# EAGLE design debug-leds (EAGLE 7.7.0)
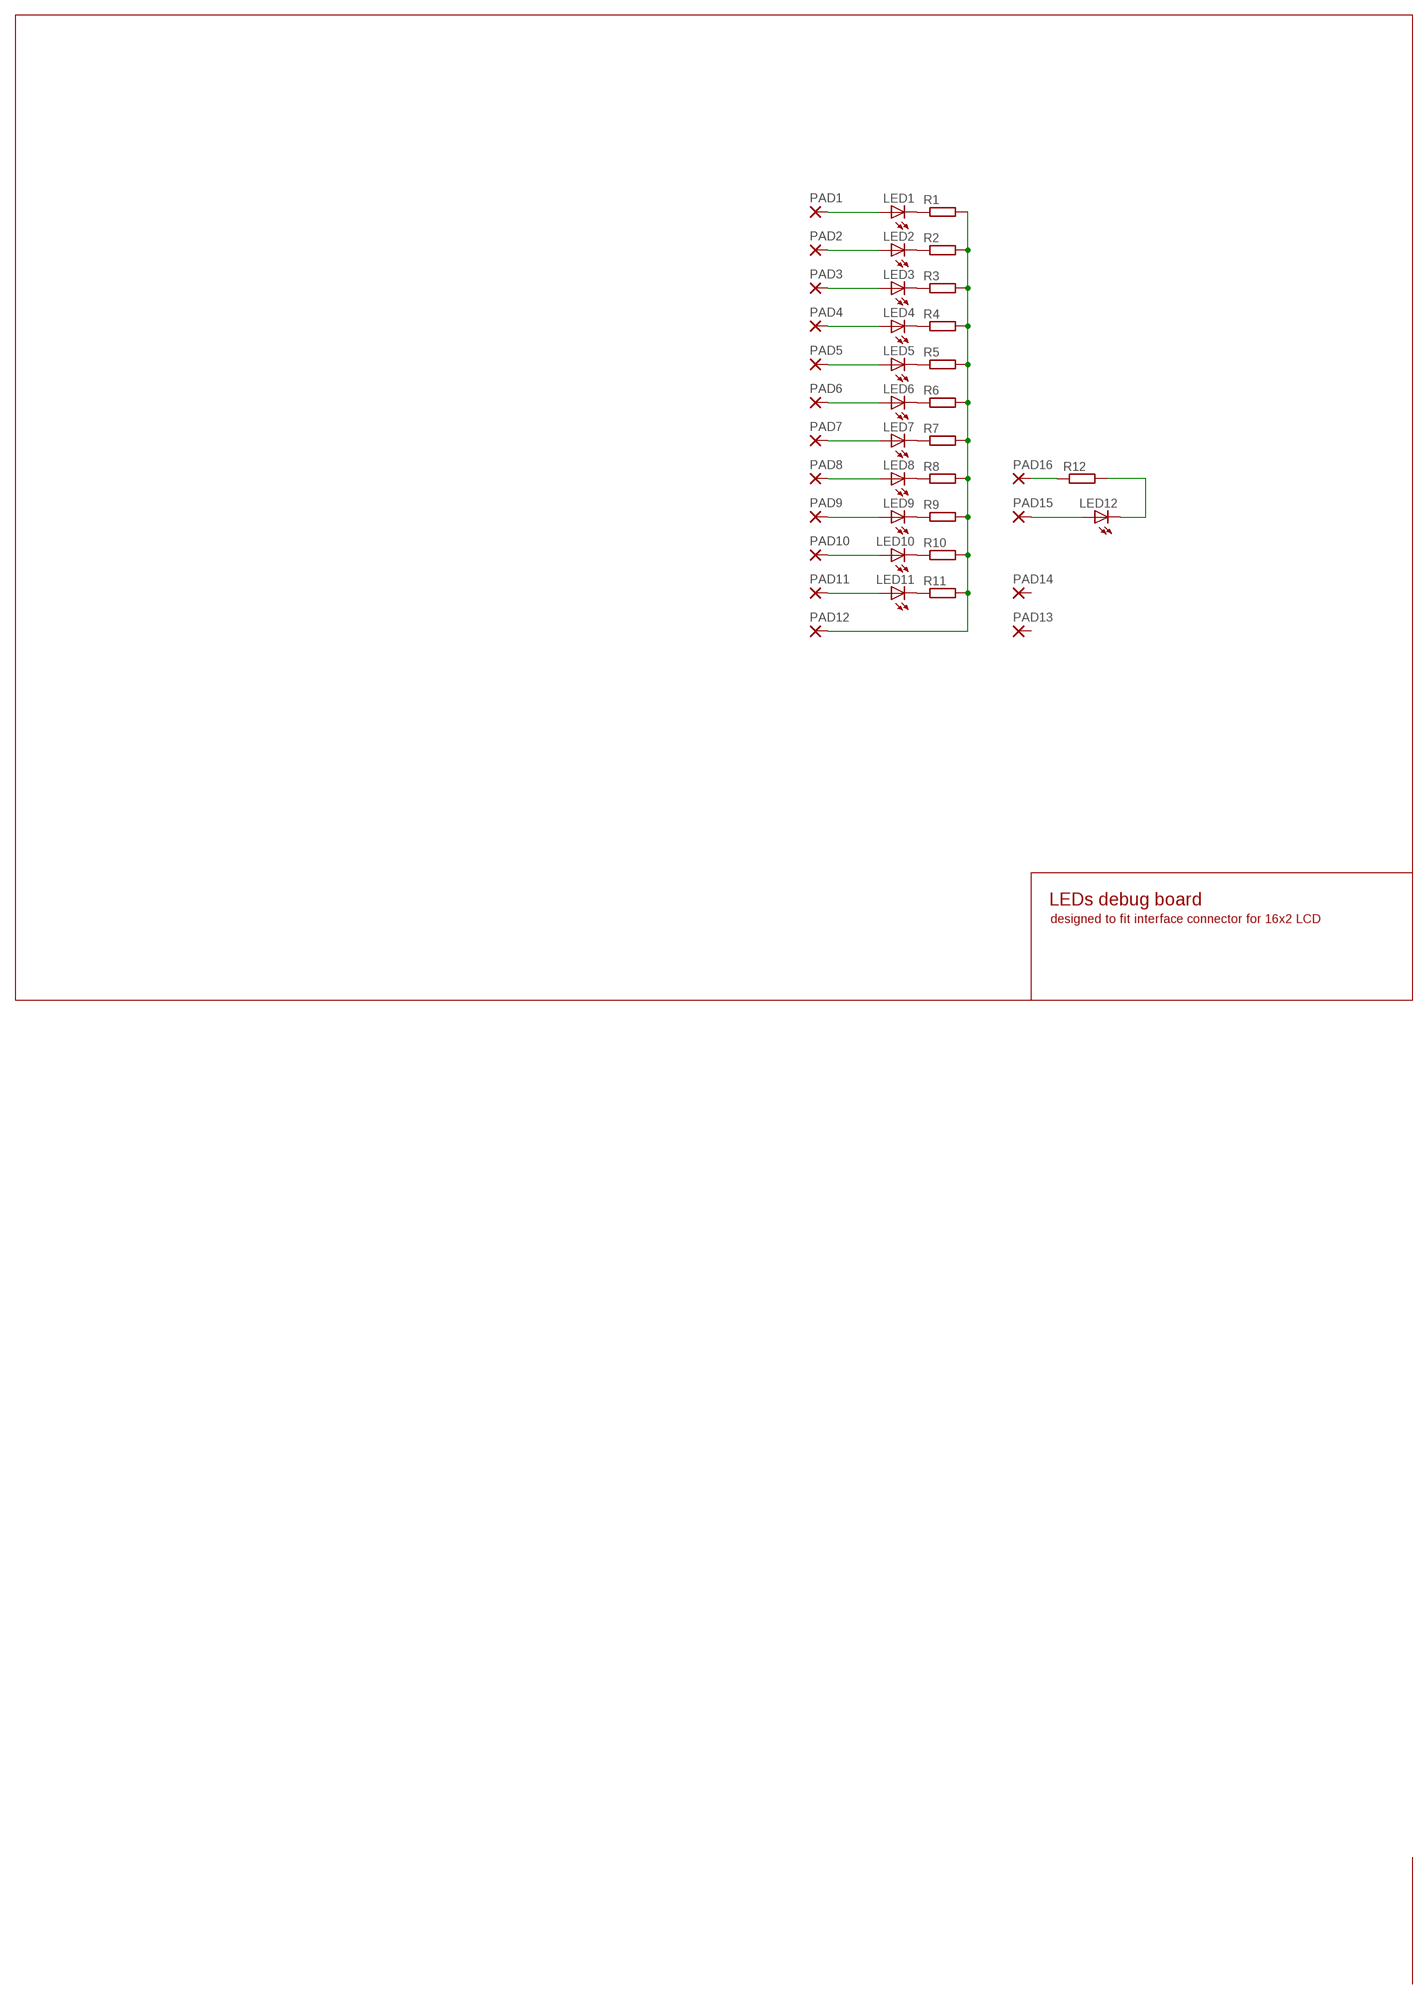
[diagram p0: schematic, sheet 1]

## Parts
LED1  LEDSML0805  [SML0805]
LED2  LEDSML0805  [SML0805]
LED3  LEDSML0805  [SML0805]
LED4  LEDSML0805  [SML0805]
LED5  LEDSML0805  [SML0805]
LED6  LEDSML0805  [SML0805]
LED7  LEDSML0805  [SML0805]
LED8  LEDSML0805  [SML0805]
LED9  LEDSML0805  [SML0805]
LED10  LEDSML0805  [SML0805]
LED11  LEDSML0805  [SML0805]
LED12  LEDSML0805  [SML0805]
PAD1  1,6/0,8  [1,6/0,8]
PAD2  1,6/0,8  [1,6/0,8]
PAD3  1,6/0,8  [1,6/0,8]
PAD4  1,6/0,8  [1,6/0,8]
PAD5  1,6/0,8  [1,6/0,8]
PAD6  1,6/0,8  [1,6/0,8]
PAD7  1,6/0,8  [1,6/0,8]
PAD8  1,6/0,8  [1,6/0,8]
PAD9  1,6/0,8  [1,6/0,8]
PAD10  1,6/0,8  [1,6/0,8]
PAD11  1,6/0,8  [1,6/0,8]
PAD12  1,6/0,8  [1,6/0,8]
PAD13  1,6/0,8  [1,6/0,8]
PAD14  1,6/0,8  [1,6/0,8]
PAD15  1,6/0,8  [1,6/0,8]
PAD16  1,6/0,8  [1,6/0,8]
R1  R-EU_M0805  [M0805]
R2  R-EU_M0805  [M0805]
R3  R-EU_M0805  [M0805]
R4  R-EU_M0805  [M0805]
R5  R-EU_M0805  [M0805]
R6  R-EU_M0805  [M0805]
R7  R-EU_M0805  [M0805]
R8  R-EU_M0805  [M0805]
R9  R-EU_M0805  [M0805]
R10  R-EU_M0805  [M0805]
R11  R-EU_M0805  [M0805]
R12  R-EU_M0805  [M0805]

## Nets
D6: LED2.A PAD2.1(P)
D7: LED1.A PAD1.1(P)
GND: PAD12.1(P) R1.2 R2.2 R3.2 R4.2 R5.2 R6.2 R7.2 R8.2 R9.2 R10.2 R11.2
N$1: LED9.A PAD9.1(P)
N$2: LED10.A PAD10.1(P)
N$3: LED3.A PAD3.1(P)
N$4: LED4.A PAD4.1(P)
N$5: LED5.A PAD5.1(P)
N$6: LED6.A PAD6.1(P)
N$7: LED7.A PAD7.1(P)
N$8: LED8.A PAD8.1(P)
N$9: LED1.C R1.1
N$10: LED2.C R2.1
N$11: LED3.C R3.1
N$12: LED4.C R4.1
N$13: LED5.C R5.1
N$14: LED6.C R6.1
N$15: LED7.C R7.1
N$16: LED8.C R8.1
N$17: LED11.A PAD11.1(P)
N$18: LED9.C R9.1
N$19: LED10.C R10.1
N$20: LED11.C R11.1
N$22: LED12.A PAD15.1(P)
N$23: LED12.C R12.2
N$24: PAD16.1(P) R12.1
Unconnected: PAD13.1(P) PAD14.1(P)

## Notes on the sheet
- LEDs debug board
- designed to fit interface connector for 16x2 LCD

## Library data of the parts
LED1-LED12 = led:LED: LED OSRAM: - CHIPLED LG R971, LG N971, LY N971, LG Q971, LY Q971, LO R971, LY R971 LH N974, LH R974 LS Q976, LO Q976, LY Q976 LO Q996 - Hyper CHIPLED LW Q18S LB Q993, LB Q99A, LB R99A - SideLED LS A670, LO A670, LY A670, LG A670, LP A670 LB A673, LV A673, LT A673, LW A673 LH A674 LY A675 LS A676, LA A676, LO A676, LY A676, LW A676 LS A679, LY A679, LG A679 - Hyper Micro SIDELED® LS Y876, LA Y876, LO Y876, LY Y876 LT Y87S - SmartLED LW L88C, LW L88S LB L89C, LB L89S, LG L890 LS L89K, LO L89K, LY L89K LS L896, LA L896, LO L896, LY L896 - TOPLED LS T670, LO T670, LY T670, LG T670, LP T670 LSG T670, LSP T670, LSY T670, LOP T670, LYG T670 LG T671, LOG T671, LSG T671 LB T673, LV T673, LT T673, LW T673 LH T674 LS T676, LA T676, LO T676, LY T676, LB T676, LH T676, LSB T676, LW T676 LB T67C, LV T67C, LT T67C, LS T67K, LO T67K, LY T67K, LW E67C LS E67B, LA E67B, LO E67B, LY E67B, LB E67C, LV E67C, LT E67C LW T67C LS T679, LY T679, LG T679 LS T770, LO T770, LY T770, LG T770, LP T770 LB T773, LV T773, LT T773, LW T773 LH T774 LS E675, LA E675, LY E675, LS T675 LS T776, LA T776, LO T776, LY T776, LB T776 LHGB T686 LT T68C, LB T68C - Hyper Mini TOPLED® LB M676 - Mini TOPLED Santana® LG M470 LS M47K, LO M47K, LY M47K Source: http://www.osram.convergy.de LUXEON: - LUMILED® LXK2-PW12-R00, LXK2-PW12-S00, LXK2-PW14-U00, LXK2-PW14-V00 LXK2-PM12-R00, LXK2-PM12-S00, LXK2-PM14-U00 LXK2-PE12-Q00, LXK2-PE12-R00, LXK2-PE12-S00, LXK2-PE14-T00, LXK2-PE14-U00 LXK2-PB12-K00, LXK2-PB12-L00, LXK2-PB12-M00, LXK2-PB14-N00, LXK2-PB14-P00, LXK2-PB14-Q00 LXK2-PR12-L00, LXK2-PR12-M00, LXK2-PR14-Q00, LXK2-PR14-R00 LXK2-PD12-Q00, LXK2-PD12-R00, LXK2-PD12-S00 LXK2-PH12-R00, LXK2-PH12-S00 LXK2-PL12-P00, LXK2-PL12-Q00, LXK2-PL12-R00 Source: www.luxeon.com KINGBRIGHT: KA-3528ASYC Source: www.kingbright.com
PAD1-PAD16 = wirepad:1,6/0,8: THROUGH-HOLE PAD
R1-R12 = rcl:R-EU_: RESISTOR, European symbol

## Board
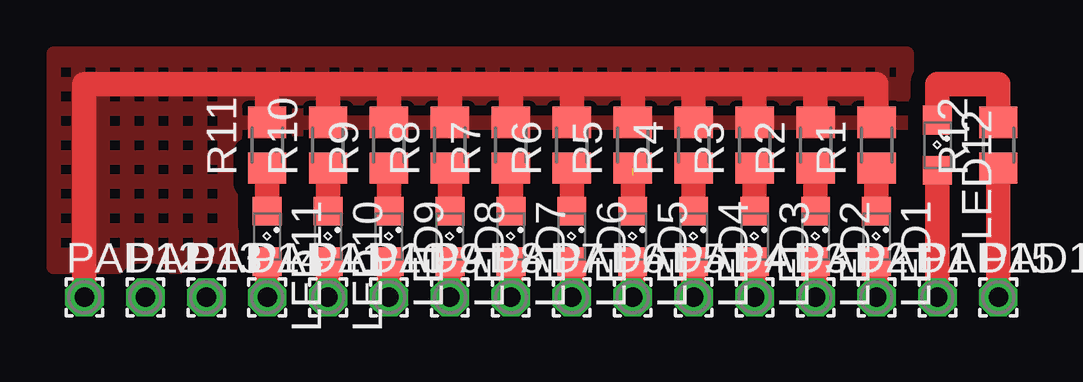
[diagram p1: board, top side]

No outline drawn. Coordinates in mm, seen from the top.
Copper layers (1*16): Top 0.035mm / dielectric 1.5mm / Bottom 0.035mm
Design rules "default": minimum track width 10mil, minimum drill 24mil, track to track 8mil, track to pad 8mil, pad to pad 8mil, via to via 8mil, smd to smd 8mil, copper to edge 40mil, drill to drill 8mil, minimum pad ring 10mil, minimum via ring 8mil, stop-mask expansion 4mil, vias tented up to drill 0mil, thermal gap 10mil

### Footprints (pad centres in the part's own frame; a part is rotated, then mirrored left to right if it is on the bottom)
SML0805 = smd 1.2 x 1.2: A 1.05,0; C -1.05,0
1,6/0,8 = drill 0.813 pad 1.6 octagon: 1 0,0
M0805 = smd 1.3 x 1.6: 1 -0.95,0; 2 0.95,0

### Placement (x,y rotation side)
LED1  34.29,3.81 270 top
LED2  31.75,3.81 270 top
LED3  29.21,3.81 270 top
LED4  26.67,3.81 270 top
LED5  24.13,3.81 270 top
LED6  21.59,3.81 270 top
LED7  19.05,3.81 270 top
LED8  16.51,3.81 270 top
LED9  13.97,3.81 270 top
LED10  11.43,3.81 270 top
LED11  8.89,3.81 270 top
LED12  36.83,7.62 270 top
PAD1  34.29,1.27 0 top
PAD2  31.75,1.27 0 top
PAD3  29.21,1.27 0 top
PAD4  26.67,1.27 0 top
PAD5  24.13,1.27 0 top
PAD6  21.59,1.27 0 top
PAD7  19.05,1.27 0 top
PAD8  16.51,1.27 0 top
PAD9  13.97,1.27 0 top
PAD10  11.43,1.27 0 top
PAD11  8.89,1.27 0 top
PAD12  1.27,1.27 0 top
PAD13  3.81,1.27 0 top
PAD14  6.35,1.27 0 top
PAD15  36.83,1.27 0 top
PAD16  39.37,1.27 0 top
R1  34.29,7.62 90 top
R2  31.75,7.62 90 top
R3  29.21,7.62 90 top
R4  26.67,7.62 90 top
R5  24.13,7.62 90 top
R6  21.59,7.62 90 top
R7  19.05,7.62 90 top
R8  16.51,7.62 90 top
R9  13.97,7.62 90 top
R10  11.43,7.62 90 top
R11  8.89,7.62 90 top
R12  39.37,7.62 90 top

### Tracks (layer width: path | path; a pad name or v marks a point on that pad's centre or on a via)
D6
  Top 1.016: PAD2.1 LED2.A
D7
  Top 1.016: PAD1.1 LED1.A
GND
  Top 1.016: PAD12.1 1.27,10.16 8.89,10.16 | 8.89,10.16 11.43,10.16 | 11.43,10.16 13.97,10.16 | 13.97,10.16 16.51,10.16 | 16.51,10.16 19.05,10.16 | 19.05,10.16 21.59,10.16 | 21.59,10.16 24.13,10.16 | 24.13,10.16 26.67,10.16 | 26.67,10.16 29.21,10.16 | 29.21,10.16 31.75,10.16 | 31.75,10.16 34.29,10.16 R1.2 | R2.2 31.75,10.16 | R3.2 29.21,10.16 | R4.2 26.67,10.16 | R5.2 24.13,10.16 | R6.2 21.59,10.16 | R7.2 19.05,10.16 | R8.2 16.51,10.16 | R9.2 13.97,10.16 | R10.2 11.43,10.16 | R11.2 8.89,10.16
  pour Top (isolate 0.61, hatched): 0,2.54 35.56,2.54 35.56,11.43 0,11.43
N$1
  Top 1.016: LED9.A PAD9.1
N$2
  Top 1.016: LED10.A PAD10.1
N$3
  Top 1.016: PAD3.1 LED3.A
N$4
  Top 1.016: PAD4.1 LED4.A
N$5
  Top 1.016: PAD5.1 LED5.A
N$6
  Top 1.016: PAD6.1 LED6.A
N$7
  Top 1.016: PAD7.1 LED7.A
N$8
  Top 1.016: PAD8.1 LED8.A
N$9
  Top 1.016: LED1.C R1.1
N$10
  Top 1.016: LED2.C R2.1
N$11
  Top 1.016: LED3.C R3.1
N$12
  Top 1.016: LED4.C R4.1
N$13  (1 unrouted)
  Top 1.016: LED5.C 24.13,6.35
N$14
  Top 1.016: LED6.C R6.1
N$15
  Top 1.016: LED7.C R7.1
N$16
  Top 1.016: LED8.C R8.1
N$17
  Top 1.016: LED11.A PAD11.1
N$18
  Top 1.016: LED9.C R9.1
N$19
  Top 1.016: LED10.C R10.1
N$20
  Top 1.016: LED11.C R11.1
N$22
  Top 1.016: PAD15.1 LED12.A
N$23
  Top 1.016: LED12.C 36.83,10.16 39.37,10.16 R12.2
N$24
  Top 1.016: R12.1 PAD16.1